# EAGLE schematic detector (EAGLE 7.6.0)
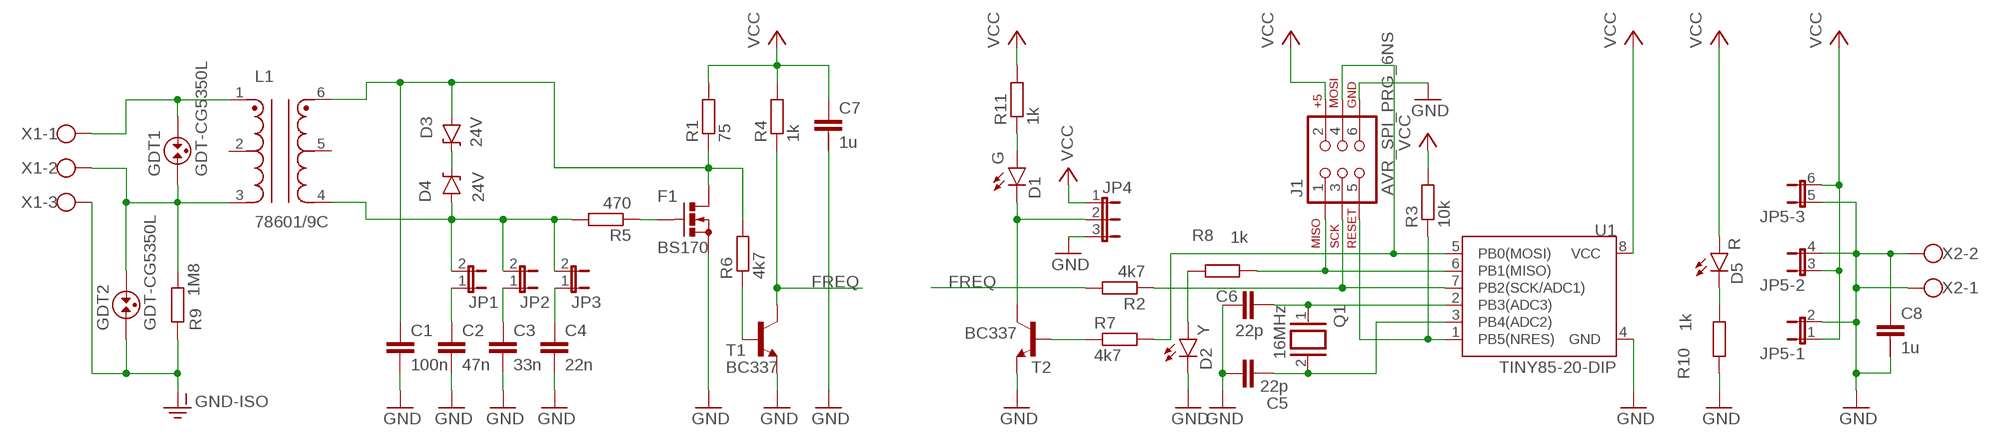
[diagram p0: schematic, sheet 1]

## Parts
C1  100n  C-EU050-024X044  [C050-024X044]
C2  47n  C-EU050-024X044  [C050-024X044]
C3  33n  C-EU050-024X044  [C050-024X044]
C4  22n  C-EU050-024X044  [C050-024X044]
C5  22p  C-EU050-024X044  [C050-024X044]
C6  22p  C-EU050-024X044  [C050-024X044]
C7  1u  C-2.5-5/4  [C2.5/5-4]
C8  1u  C-2.5-5/4  [C2.5/5-4]
D1  G  LED3MM  [LED3MM]
D2  Y  LED3MM  [LED3MM]
D3  24V  DIODE-ZENER  [DIODE-BZT52]
D4  24V  DIODE-ZENER  [DIODE-BZT52]
D5  R  LED3MM  [LED3MM]
F1  BS170  [SOT54E]
GDT1  GDT-CG5350L  [CG5350L]
GDT2  GDT-CG5350L  [CG5350L]
J1  AVR_SPI_PRG_6NS  [2X3-NS]
JP1  JUMPER-2PTH  [1X02]
JP2  JUMPER-2PTH  [1X02]
JP3  JUMPER-2PTH  [1X02]
JP4  JP2E  [JP2]
JP5  JP3QE  [JP3Q]
L1  78601/9C  [78601/9C]
Q1  16MHz  XTAL/S  [QS]
R1  75  R-EU_0204/7  [0204/7]
R2  4k7  R-EU_0204/5  [0204/5]
R3  10k  R-EU_0204/5  [0204/5]
R4  1k  R-EU_0204/5  [0204/5]
R5  470  R-EU_0204/5  [0204/5]
R6  4k7  R-EU_0204/5  [0204/5]
R7  4k7  R-EU_0204/5  [0204/5]
R8  1k  R-EU_0204/5  [0204/5]
R9  1M8  R-EU_0204/5  [0204/5]
R10  1k  R-EU_0204/5  [0204/5]
R11  1k  R-EU_0204/5  [0204/5]
T1  BC337  BC337-NPN-TO92-CBE  [TO92-CBE]
T2  BC337  BC337-NPN-TO92-CBE  [TO92-CBE]
U1  TINY85-20-DIP  ATTINY45TINY45-20-DIP  [DIP08]
X1  W237-103  [W237-103]
X2  W237-102  [W237-102]

## Nets
FREQ: R2.2 R4.1 T1.C
GND: C1.2 C2.2 C3.2 C4.2 C5.1 C6.1 C7.2 C8.1 C8.2 D2.K(C) F1.S J1.6 JP4.3 JP5.2 JP5.4 JP5.5 R10.2 T1.E T2.E U1.4(GND) X2.1 X2.2
GND-ISO: GDT2.1 R9.1 X1.3
N$1: D3.C D4.C
N$2: R6.1 T1.B
N$3: F1.G R5.1
N$4: C3.1 JP2.1
N$5: C4.1 JP3.1
N$6: D4.A JP1.2 JP2.2 JP3.2 L1.4 R5.2
N$7: GDT1.2 L1.1 X1.1
N$8: R7.1 T2.B
N$9: J1.1 R8.1 U1.6(PB1(MISO))
N$10: D2.A R8.2
N$11: C2.1 JP1.1
N$12: J1.4 R7.2 U1.5(PB0(MOSI))
N$13: D1.A R11.1
N$14: C1.1 D3.A F1.D L1.6 R1.1 R6.2
N$15: C6.2 Q1.1 U1.2(PB3(ADC3))
N$16: D1.K(C) JP4.2 T2.C
N$17: J1.5 R3.1 U1.1(PB5(NRES))
N$18: C5.2 Q1.2 U1.3(PB4(ADC2))
N$19: J1.3 R2.1 U1.7(PB2(SCK/ADC1))
N$21: GDT1.1 GDT2.2 L1.3 R9.2 X1.2
N$22: D5.K(C) R10.1
VCC: C7.1 D5.A J1.2 JP4.1 JP5.1 JP5.3 JP5.6 R1.2 R3.2 R4.2 R11.2 U1.8(VCC)
Unconnected: C7.3 C8.3 L1.2 L1.5

## Library data of the parts
C1-C6 = resistor:C-EU: CAPACITOR, European symbol
C7 C8 = capacitor-wima:C-: CAPACITOR for alternative placement naming: default grid - extended grid/package width
D1 D2 D5 = SparkFun-LED:LED: LEDs Standard schematic elements and footprints for 5mm, 3mm, 1206, and 0603 sized LEDs. 5mm - Spark Fun Electronics SKU : COM-00529 (and others); PROD_ID: DIO-08794
D3 D4 = SparkFun-DiscreteSemi:DIODE-ZENER: Zener Diode Production Part - 8199 3.4V Zener Voltage; PROD-ID: DIO-08199; VALUE: BZT52
F1 = transistor-small-signal:BS170: N-CHANNEL MOS FET
GDT1 GDT2 = supressor:GDT-: GAS DISCHARGE TUBE
J1 = SparkFun-Connectors:AVR_SPI_PRG_6: AVR ISP 6 Pin This is the reduced ISP connector for AVR programming. Common on Arduino. This footprint will take up less PCB space and can be used with a 10-pin to 6-pin adapter such as SKU: BOB-08508 **Special note about "TEST_POINT" package. The stop mask is on the top side, so if you want your programming test points to be on the bottom of your board, make sure to place this package on the bottom side of the board. This also ensure that the orientation to program from the bottom side will be correct.
JP1-JP3 = SparkFun-Retired:JUMPER-2: Jumper Basic 0.1" spaced jumper. Use with breakaway headers.
JP4 = jumper:JP2E: JUMPER
JP5 = jumper:JP3QE: JUMPER
L1 = detector:78601/9C: MuRata 78601/9C
Q1 = special:XTAL/S: CRYSTAL
R1-R11 = resistor:R-EU_: RESISTOR, European symbol
T1 T2 = transistor:*-NPN-: NPN Transistror BF959 corrected 2008.03.06
U1 = SparkFun-DigitalIC:ATTINY45: Atmel 8-pin 2/4/8kB flash uC; PROD_ID: IC-09439; VALUE: TINY45-20-DIP
X1 = con-wago-500:W237-103: WAGO SCREW CLAMP; MPN: 237-103; OC_FARNELL: unknown; OC_NEWARK: 18M7116
X2 = con-wago-500:W237-102: WAGO SCREW CLAMP; MPN: 237-102; OC_FARNELL: unknown; OC_NEWARK: 70K9898